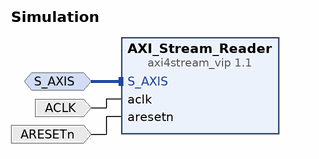
[diagram p0: block diagram of the top level]
# Vivado block design Simulation, xc7z010clg400-1, Vivado 2020.2
create_bd_design Simulation

create_bd_intf_port -mode Slave -vlnv xilinx.com:interface:axis_rtl:1.0 S_AXIS
set_property -dict [list \
  CONFIG.FREQ_HZ 125000000 \
  CONFIG.HAS_TKEEP 0 \
  CONFIG.HAS_TLAST 0 \
  CONFIG.HAS_TREADY 1 \
  CONFIG.HAS_TSTRB 0 \
  CONFIG.LAYERED_METADATA undef \
  CONFIG.TDATA_NUM_BYTES 4 \
  CONFIG.TDEST_WIDTH 0 \
  CONFIG.TID_WIDTH 0 \
  CONFIG.TUSER_WIDTH 0 \
] [get_bd_intf_ports S_AXIS]
create_bd_port -dir I -type clk ACLK
set_property -dict {CONFIG.ASSOCIATED_RESET ARESETN CONFIG.FREQ_HZ 125000000} [get_bd_ports ACLK]
create_bd_port -dir I -type rst ARESETn

create_bd_cell -type ip -vlnv xilinx.com:ip:axi4stream_vip:1.1 AXI_Stream_Reader
set_property -dict {CONFIG.INTERFACE_MODE SLAVE CONFIG.TDATA_NUM_BYTES 4} [get_bd_cells AXI_Stream_Reader]

# ---- connections ----

connect_bd_intf_net -intf_net S_AXIS_0_1 [get_bd_intf_ports S_AXIS] [get_bd_intf_pins AXI_Stream_Reader/S_AXIS]
connect_bd_net -net aclk_0_1 [get_bd_ports ACLK] [get_bd_pins AXI_Stream_Reader/aclk]
connect_bd_net -net aresetn_0_1 [get_bd_ports ARESETn] [get_bd_pins AXI_Stream_Reader/aresetn]

validate_bd_design
save_bd_design
